# Altium project CCjammerRev2.PrjPCB
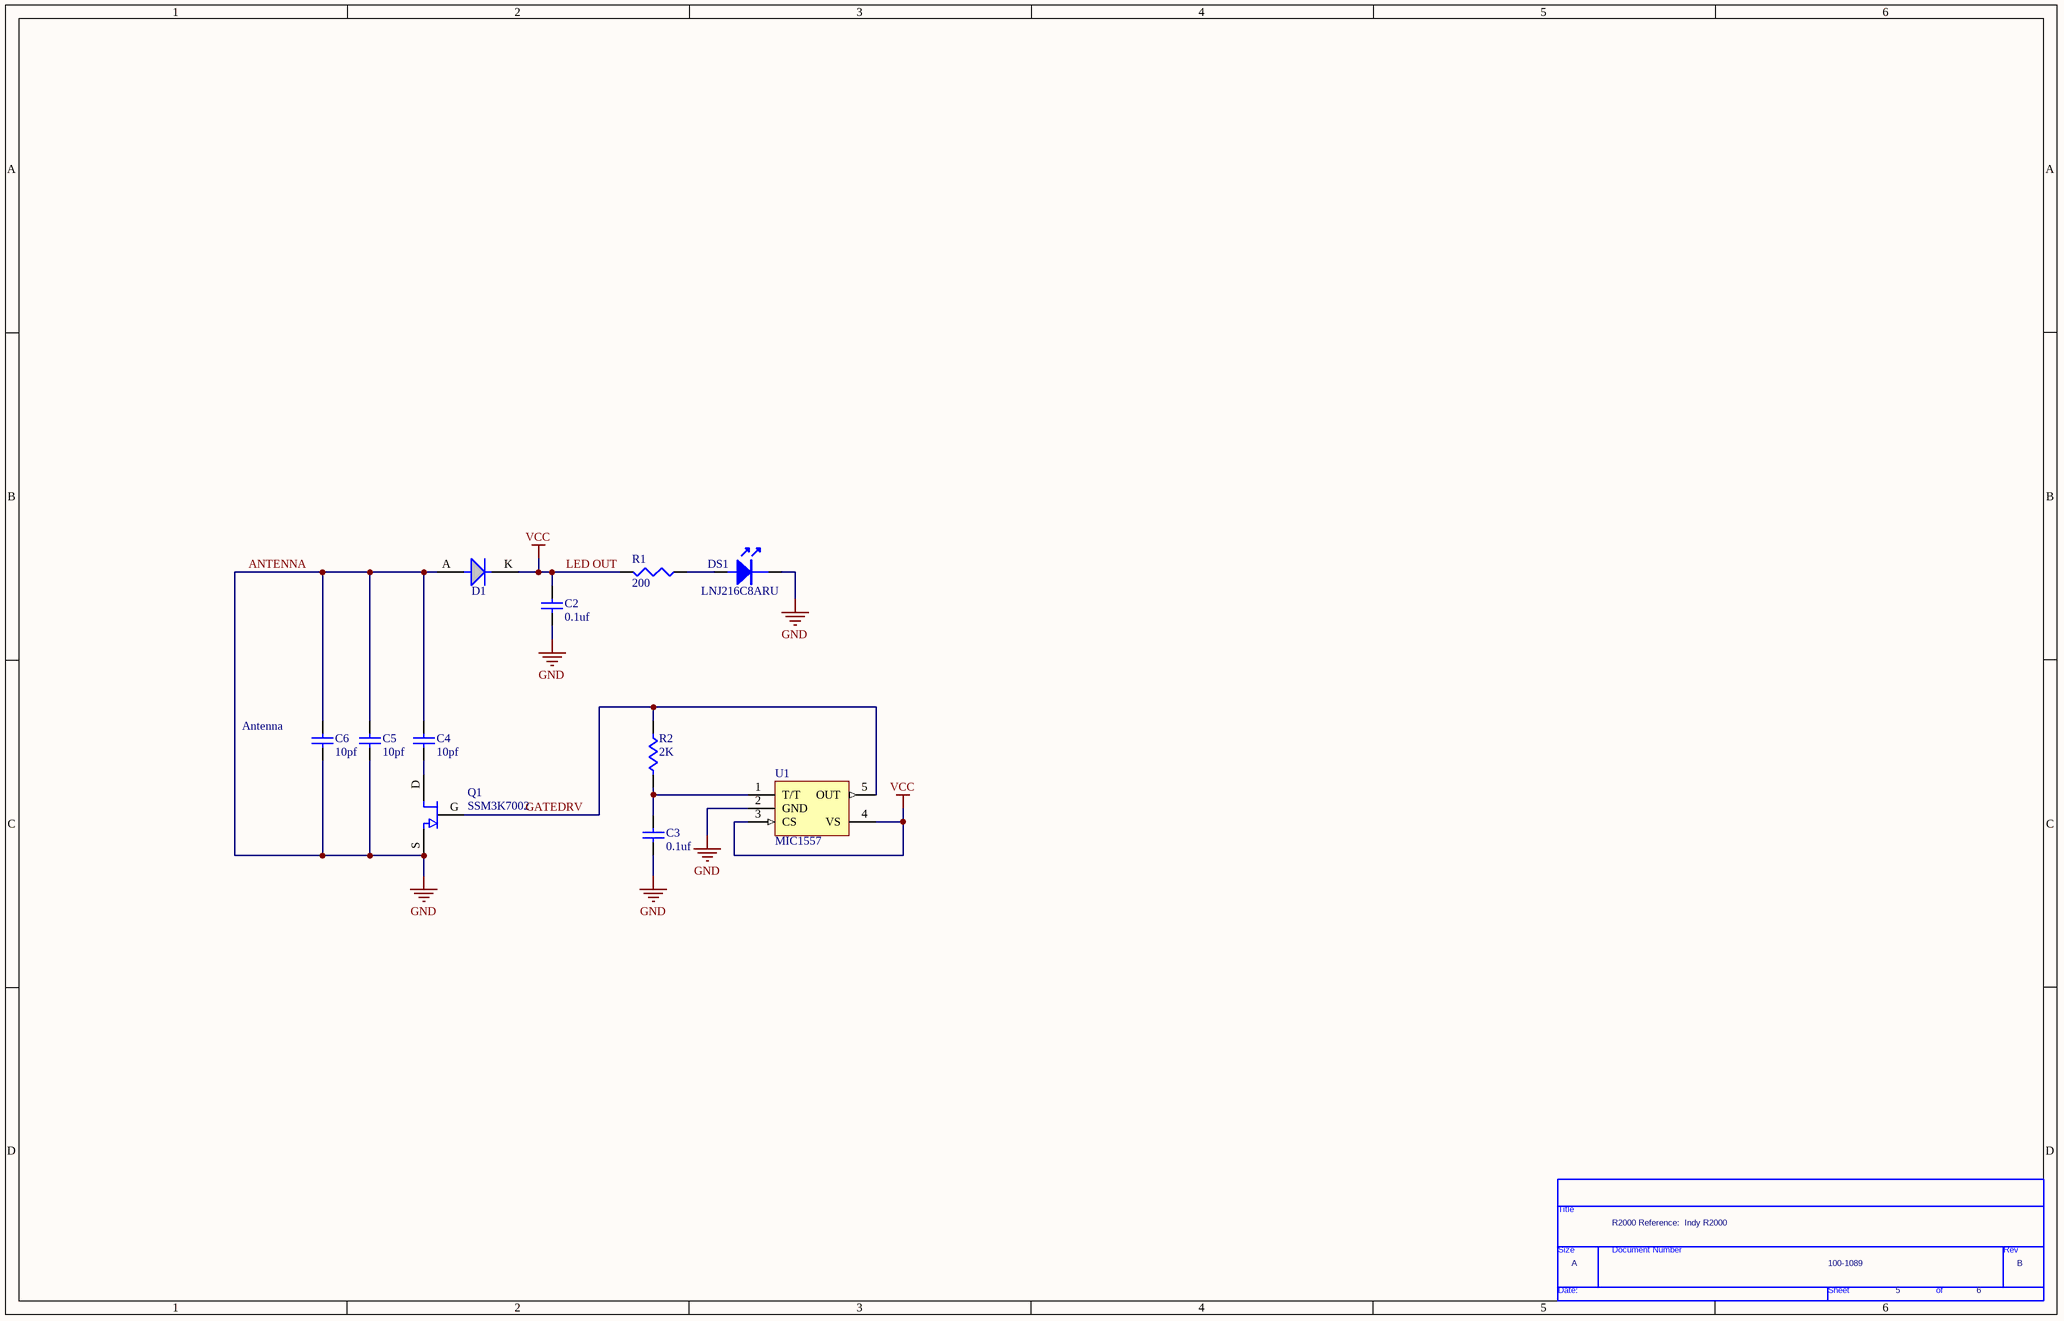
[diagram p0: CCjammerRev2_TOP.SchDoc]
1 sheet, 12 parts. Net scope: global (net labels, ports and power ports of the same name join across sheets).
Board file: CCjammerRev2.PcbDoc

## Sheet CCjammerRev2_TOP.SchDoc
size 386 x 246 mm

### Parts
*  Page Count: 6  Page Number: 5  Page Size: A  Title: R2000 Reference:  Indy R2000  RevCode: B  Doc: 100-1089  (hidden comment: TitleBlock0)  (graphical)
C2  0.1uf  [0603_072205]
C3  0.1uf  [0603_072205]
C4  10pf  [0603_072205]
C5  10pf  [0603_072205]
C6  10pf  [0603_072205]
D1  1SS416  [DIODE_FSC_091912]  (value not drawn)
DS1  LNJ216C8ARU  [404-1032-2-ND]
Q1  SSM3K7002  [SOT23 SMALL_FET_012005]
R1  200  [0603]
R2  2K  [0603_072205]
U1  MIC1557  [SOT25_030205]

### Nets
ANTENNA: C2.1 C3.1 C4.2 C5.1 C5.2 C6.1 C6.2 D1.A DS1.K Q1.S U1.2(GND)  [also labelled GND]
LED OUT: C2.2 D1.K R1.2 U1.3(CS) U1.4(VS)  [also labelled VCC]
GATEDRV: Q1.G R2.2 U1.5(OUT)
NetC3_2: C3.2 R2.1 U1.1(T/T)
NetC4_1: C4.1 Q1.D
NetDS1_A: DS1.A R1.1

### Notes on the sheet
- (near C6) Antenna
- (in symbol TitleBlock0) Title; Size; Document Number; Rev; Date:; Sheet; of

### Library data of the parts
C2 = Cap: Capacitor; PARTNO: TMK212BJ475KG-T; MAN: Taiyo Yuden; VALUE: 0.1uf; DK: 587-1782-1-ND
C3-C6 = Cap: Capacitor
  C3: VALUE: 0.1uf
  C4-C6: VALUE: 10pf
D1 = DIODE: PARTNO: 1SS416(TL4D)TR-ND; MFG: Toshiba; VALUE: Diode; VALUE: 1SS416
DS1 = LED: MANUFACTURER: Panasonic; ITEM-DESCRIPTION: LED RED THRU BOARD W/LENS 1206; MFGR-P/N: P11544TR-ND; ACTIVEWAVE-P/N: *; VALUE: LNJ216C8ARU
Q1 = FET N CHANNEL: PARTNO: SSM3K7002BFU; MFG: Toshiba; VALUE: SSM3K7002; DK: SSM3K7002BFU(T5LFTR-ND
R1 = RES-0603: ACTIVEWAVE-P/N: *; MFGR-P/N: *; MANUFACTURER: *; ITEM-DESCRIPTION: *; VALUE: 200
R2 = RESISTOR: PARTNO: RES-0000; VALUE: 2K
U1 = MIC1555: PARTNO: MIC1557YM5; MFG: Micrel; VALUE: MIC1557
* = TitleBlock0: Page Create Date: March  8, 1995